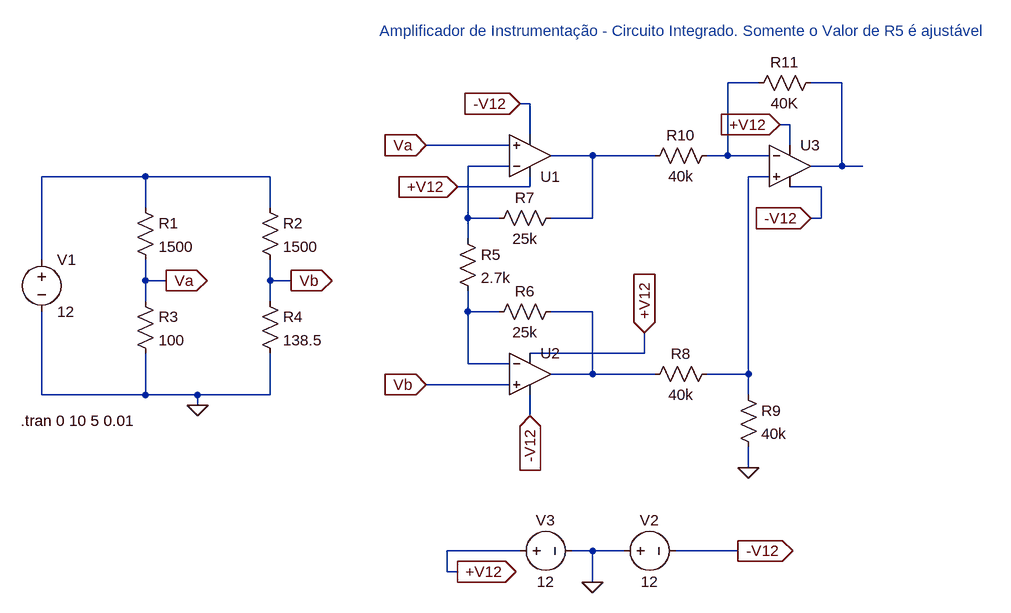
[diagram p0: schematic circuito.asc]
circuito.asc, the LTspice schematic file:
Version 4
SHEET 1 1512 696
WIRE 1072 -128 1024 -128
WIRE 1200 -128 1152 -128
WIRE 720 -96 704 -96
WIRE 1120 -64 1104 -64
WIRE 720 -48 720 -96
WIRE 688 -32 560 -32
WIRE 1120 -32 1120 -64
WIRE 816 -16 752 -16
WIRE 912 -16 816 -16
WIRE 1024 -16 1024 -128
WIRE 1024 -16 992 -16
WIRE 1088 -16 1024 -16
WIRE 688 0 624 0
WIRE 1200 0 1200 -128
WIRE 1200 0 1152 0
WIRE 1232 0 1200 0
WIRE 128 16 -32 16
WIRE 320 16 128 16
WIRE 1088 16 1056 16
WIRE 720 32 720 16
WIRE 720 32 608 32
WIRE 1168 32 1120 32
WIRE 128 64 128 16
WIRE 320 64 320 16
WIRE 624 80 624 0
WIRE 672 80 624 80
WIRE 816 80 816 -16
WIRE 816 80 752 80
WIRE 1168 80 1168 32
WIRE 1168 80 1152 80
WIRE 624 112 624 80
WIRE -32 144 -32 16
WIRE 128 176 128 144
WIRE 160 176 128 176
WIRE 320 176 320 144
WIRE 352 176 320 176
WIRE 128 208 128 176
WIRE 320 208 320 176
WIRE 624 224 624 192
WIRE 672 224 624 224
WIRE 816 224 752 224
WIRE 896 288 896 256
WIRE 896 288 720 288
WIRE 624 304 624 224
WIRE 688 304 624 304
WIRE 816 320 816 224
WIRE 816 320 752 320
WIRE 912 320 816 320
WIRE 1056 320 1056 16
WIRE 1056 320 992 320
WIRE 688 336 560 336
WIRE -32 352 -32 224
WIRE 128 352 128 288
WIRE 128 352 -32 352
WIRE 208 352 128 352
WIRE 320 352 320 288
WIRE 320 352 208 352
WIRE 1056 352 1056 320
WIRE 208 368 208 352
WIRE 720 384 720 352
WIRE 1056 464 1056 432
WIRE 704 592 592 592
WIRE 816 592 784 592
WIRE 864 592 816 592
WIRE 1040 592 944 592
WIRE 592 624 592 592
WIRE 608 624 592 624
WIRE 816 640 816 592
FLAG 208 368 0
FLAG 1056 464 0
FLAG 816 640 0
FLAG 608 624 +V12
IOPIN 608 624 Out
FLAG 1040 592 -V12
IOPIN 1040 592 Out
FLAG 160 176 Va
IOPIN 160 176 Out
FLAG 352 176 Vb
IOPIN 352 176 Out
FLAG 560 -32 Va
IOPIN 560 -32 In
FLAG 560 336 Vb
IOPIN 560 336 In
FLAG 720 384 -V12
IOPIN 720 384 In
FLAG 608 32 +V12
IOPIN 608 32 In
FLAG 1152 80 -V12
IOPIN 1152 80 In
FLAG 704 -96 -V12
IOPIN 704 -96 In
FLAG 1104 -64 +V12
IOPIN 1104 -64 In
FLAG 896 256 +V12
IOPIN 896 256 In
DATAFLAG 1216 0 ""
SYMBOL res 112 48 R0
SYMATTR InstName R1
SYMATTR Value 1500
SYMBOL res 304 48 R0
SYMATTR InstName R2
SYMATTR Value 1500
SYMBOL res 112 192 R0
SYMATTR InstName R3
SYMATTR Value 100
SYMBOL res 304 192 R0
SYMATTR InstName R4
SYMATTR Value 138.5
SYMBOL voltage -32 128 R0
WINDOW 123 0 0 Left 0
WINDOW 39 24 124 Left 2
SYMATTR InstName V1
SYMATTR Value 12
SYMBOL res 608 96 R0
SYMATTR InstName R5
SYMATTR Value 2.7k
SYMBOL res 768 208 R90
WINDOW 0 0 56 VBottom 2
WINDOW 3 32 56 VTop 2
SYMATTR InstName R6
SYMATTR Value 25k
SYMBOL res 768 64 R90
WINDOW 0 0 56 VBottom 2
WINDOW 3 32 56 VTop 2
SYMATTR InstName R7
SYMATTR Value 25k
SYMBOL res 1008 304 R90
WINDOW 0 0 56 VBottom 2
WINDOW 3 32 56 VTop 2
SYMATTR InstName R8
SYMATTR Value 40k
SYMBOL res 1008 -32 R90
WINDOW 0 0 56 VBottom 2
WINDOW 3 32 56 VTop 2
SYMATTR InstName R10
SYMATTR Value 40k
SYMBOL res 1040 336 R0
SYMATTR InstName R9
SYMATTR Value 40k
SYMBOL voltage 848 592 R270
WINDOW 0 32 56 VTop 2
WINDOW 3 -32 56 VBottom 2
WINDOW 123 0 0 Left 0
WINDOW 39 0 0 Left 0
SYMATTR InstName V2
SYMATTR Value 12
SYMBOL voltage 688 592 R270
WINDOW 0 32 56 VTop 2
WINDOW 3 -32 56 VBottom 2
WINDOW 123 0 0 Left 0
WINDOW 39 0 0 Left 0
SYMATTR InstName V3
SYMATTR Value 12
SYMBOL res 1168 -144 R90
WINDOW 0 0 56 VBottom 2
WINDOW 3 32 56 VTop 2
SYMATTR InstName R11
SYMATTR Value 40K
SYMBOL OpAmps\\UniversalOpamp 720 320 R0
SYMATTR InstName U2
SYMBOL OpAmps\\UniversalOpamp 1120 0 R0
SYMATTR InstName U3
SYMBOL OpAmps\\UniversalOpamp 720 -16 M180
SYMATTR InstName U1
TEXT -64 392 Left 2 !.tran 0 10 5 0.01
TEXT 488 -208 Left 2 ;Amplificador de Instrumentação - Circuito Integrado. Somente o Valor de R5 é ajustável

The netlist it stands for:
* circuito.asc
R1 N005 Va 1500
R2 N005 Vb 1500
R3 Va 0 100
R4 Vb 0 138.5
V1 N005 0 12
R5 N004 N007 2.7k
R6 N008 N007 25k
R7 N003 N004 25k
R8 N006 N008 40k
R10 N001 N003 40k
R9 N006 0 40k
V2 0 -V12 12
V3 +V12 0 12
R11 N002 N001 40K
XU2 Vb N007 +V12 -V12 N008 level1 Avol=1Meg GBW=10Meg Vos=0 En=0 Enk=0 In=0 Ink=0 Rin=500Meg  ; pins In+ In- V+ V- OUT
XU3 N006 N001 +V12 -V12 N002 level1 Avol=1Meg GBW=10Meg Vos=0 En=0 Enk=0 In=0 Ink=0 Rin=500Meg  ; pins In+ In- V+ V- OUT
XU1 Va N004 +V12 -V12 N003 level1 Avol=1Meg GBW=10Meg Vos=0 En=0 Enk=0 In=0 Ink=0 Rin=500Meg  ; pins In+ In- V+ V- OUT
.tran 0 10 5 0.01
* Amplificador de Instrumentação - Circuito Integrado. Somente o Valor de R5 é ajustável
.lib UniversalOpAmp1.lib
.backanno
.end